# EAGLE design piezo-preamp-tickler_V3-single-supply-OPA1612 (EAGLE 8.3.2)
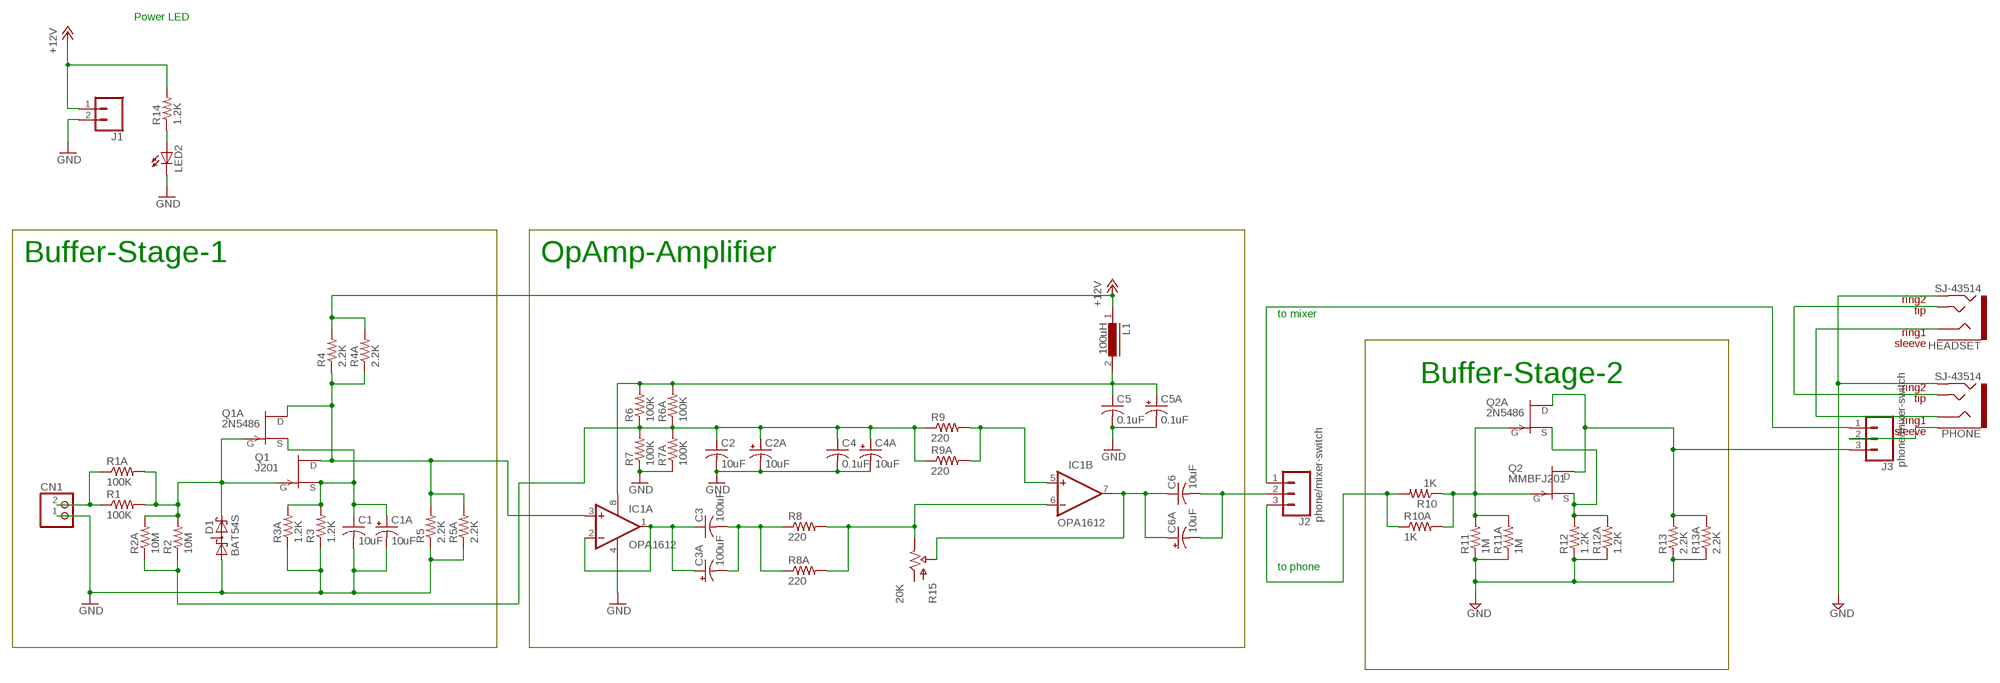
[diagram p0: schematic, sheet 1]

## Parts
C1  10uF  C-USC1206  [C1206]
C1A  10uF  CPOL-USE2,5-6E  [E2,5-6E]
C2  10uF  C-USC1206  [C1206]
C2A  10uF  CPOL-USE2,5-6E  [E2,5-6E]
C3  100uF  C-USC1206  [C1206]
C3A  100uF  CPOL-USE2,5-6E  [E2,5-6E]
C4  0.1uF  C-USC0805K  [C0805K]
C4A  10uF  CPOL-USE2,5-6E  [E2,5-6E]
C5  0.1uF  C-USC0805K  [C0805K]
C5A  0.1uF  CPOL-USE2,5-6E  [E2,5-6E]
C6  10uF  C-USC1206  [C1206]
C6A  10uF  CPOL-USE2,5-6E  [E2,5-6E]
CN1  JST_2PIN-THM  [JST-PH-2-THM]
D1  BAT54S  [SOT23]
HEADSET  SJ-43514  TRRS-3.5MMLGPADS  [TRRS_SJ-43514-SMT-TR]
IC1  OPA1612  OPA2134UA  [SO08]
J1  CONN_02LOCK  [1X02_LOCK]
J2  phone/mixer-switch  CONN_03LOCK  [1X03_LOCK]
J3  phone/mixer-switch  CONN_03LOCK  [1X03_LOCK]
L1  100uH  LBC-SE  [LBC-SE]
LED2  LED3MM  [LED3MM]
PHONE  SJ-43514  TRRS-3.5MMLGPADS  [TRRS_SJ-43514-SMT-TR]
Q1  J201  SST5484  [SOT23]
Q1A  2N5486  [TO92-]
Q2  MMBFJ201  SST5484  [SOT23]
Q2A  2N5486  [TO92-]
R1  100K  R-US_R0603  [R0603]
R1A  100K  R-US_0204/2V  [0204V]
R2  10M  R-US_R0603  [R0603]
R2A  10M  R-US_0204/2V  [0204V]
R3  1.2K  R-US_R0603  [R0603]
R3A  1.2K  R-US_0204/2V  [0204V]
R4  2.2K  R-US_R0603  [R0603]
R4A  2.2K  R-US_0204/2V  [0204V]
R5  2.2K  R-US_R0603  [R0603]
R5A  2.2K  R-US_0204/2V  [0204V]
R6  100K  R-US_R0603  [R0603]
R6A  100K  R-US_0204/2V  [0204V]
R7  100K  R-US_R0603  [R0603]
R7A  100K  R-US_0204/2V  [0204V]
R8  220  R-US_R0603  [R0603]
R8A  220  R-US_0204/2V  [0204V]
R9  220  R-US_R0603  [R0603]
R9A  220  R-US_0204/2V  [0204V]
R10  1K  R-US_R0603  [R0603]
R10A  1K  R-US_0204/2V  [0204V]
R11  1M  R-US_R0603  [R0603]
R11A  1M  R-US_0204/2V  [0204V]
R12  1.2K  R-US_R0603  [R0603]
R12A  1.2K  R-US_0204/2V  [0204V]
R13  2.2K  R-US_R0603  [R0603]
R13A  2.2K  R-US_0204/2V  [0204V]
R14  1.2K  R-US_0204/2V  [0204V]
R15  20K  POTTRIMPOT-MULTI  [TRIMPOT-MULTI]

## Nets
+12V: J1.1 L1.1 R4.2 R4A.2 R14.2
DRAINE1: IC1.3(A:+IN) Q1.1(D) Q1A.3(D) R4.1 R4A.1 R5.2 R5A.2
GATE1: D1.2(C2) Q1.3(G) Q1A.1(G) R1.2 R1A.2 R2.2 R2A.2
GATE2: Q2.3(G) Q2A.1(G) R10.1 R10A.2 R11.2 R11A.2
GND: C1.2 C1A.- C2.2 C2A.- C4.2 C4A.- C5.2 C5A.- CN1.1 D1.1(A1) HEADSET.RING2 IC1.4(A:V-) J1.2 LED2.K(C) PHONE.RING2 R3.1 R3A.1 R5.1 R5A.1 R7.1 R7A.1 R11.1 R11A.1 R12.1 R12A.1 R13.1 R13A.1
N$1: C3.1 C3A.+ IC1.1(A:OUT) IC1.2(A:-IN)
N$2: LED2.A R14.1
N$3: J2.3 R10.2 R10A.1
N$16: IC1.5(B:+IN) R9.2 R9A.2
N$22: IC1.6(B:-IN) R8.2 R8A.2 R15.P$1(OUT) R15.P$3(OUT) R15.P$4(OUT) R15.P$6(OUT) R15.P$9(OUT)
N$23: C6.2 C6A.- J2.2
N$24: CN1.2 R1.1 R1A.1
N$31: C6.1 C6A.+ IC1.7(B:OUT) R15.P$10(WIPER) R15.P$12(WIPER) R15.P$13(WIPER) R15.P$15(WIPER) R15.P$16(WIPER) R15.P$18(WIPER)
N$32: C5.1 C5A.+ IC1.8(A:V+) L1.2 R6.2 R6A.2
N$35: C2.1 C2A.+ C4.1 C4A.+ R2.1 R2A.1 R6.1 R6A.1 R7.2 R7A.2 R9.1 R9A.1
N$42: J2.1 J3.1
N$44: HEADSET.TIP PHONE.TIP
N$45: HEADSET.RING1 PHONE.RING1
N$46: J3.2 PHONE.EARTH
N$52: C3.2 C3A.- R8.1 R8A.1
NAME: J3.3 Q2.1(D) Q2A.3(D) R13.2 R13A.2
SOURCE: Q2.2(S) Q2A.2(S) R12.2 R12A.2
SOURCE1: C1.1 C1A.+ Q1.2(S) Q1A.2(S) R3.2 R3A.2
Unconnected: D1.3(C1A2) HEADSET.EARTH R15.P$20(IN) R15.P$21(IN) R15.P$22(IN) R15.P$24(IN) R15.P$27(IN)

## Notes on the sheet
- Power LED
- Buffer-Stage-1 | OpAmp-Amplifier
- to mixer
- Buffer-Stage-2
- to phone

## Library data of the parts
C1 C3-C6 = adafruit:C-US: CAPACITOR, American symbol
C1A C2A C3A C4A C5A C6A = rcl:CPOL-US: POLARIZED CAPACITOR, American symbol
C2 = rcl:C-US: CAPACITOR, American symbol
CN1 = adafruit:JST_2PIN: JST 2-Pin Connectors of various flavors SMT-RA (S2B-PH-SM4) 4UConnector #17311 SMT (B2B-PH-SM4) THM-RA (S2B-PH) THM (B2B-PH)
D1 = diode:BAT54S: Schottky Diodes Pin connection corrected 2011-05-04 Source: Fairchild .. BAT54.pdf
HEADSET PHONE = CMU-ArtFab:TRRS-3.5MM: Audio jack - 3.5mm TRRS variety - two rings.
IC1 = linear:OPA2*: Dual Operational Amplifier Low Power, Single-Supply, Rail-To-Rail Operational Amplifier Source: http://focus.ti.com/lit/ds/symlink/opa2345.pdf http://focus.ti.com .. opa241.pdf http://focus.ti.com/lit/ds/symlink/opa2134.pdf
J1 = SparkFun-Connectors:CONN_02: Multi connection point. Often used as Generic Header-pin footprint for 0.1 inch spaced/style header connections On any of the 0.1 inch spaced packages, you can populate with these: Break Away Headers - Straight <https://www.sparkfun.com/products/116> (PRT-00116) Break Away Male Headers - Right Angle <https://www.sparkfun.com/products/553> (PRT-00553) Female Headers <https://www.sparkfun.com/products/115> (PRT-00115) Break Away Headers - Machine Pin <https://www.sparkfun.com/products/117> (PRT-00117) Break Away Female Headers - Swiss Machine Pin <https://www.sparkfun.com/products/743> (PRT-00743) For SCREWTERMINALS and SPRING TERMINALS visit here: Screw Terimnals on SparkFun.com <https://www.sparkfun.com/search/results?term=Screw+Terminals> (5mm/3.5mm/2.54mm spacing) This device is also useful as a general connection point to wire up your design to another part of your project. Our various solder wires solder well into these plated through hole pads. Hook-Up Wire - Assortment (Stranded, 22 AWG) <https://www.sparkfun.com/products/11375> (PRT-11375) Hook-Up Wire - Assortment (Solid Core, 22 AWG) <https://www.sparkfun.com/products/11367> (PRT-11367) View the entire wire category on our website here <https://www.sparkfun.com/categories/141> Special notes: Molex polarized connector foot print use with: PRT-08233 with associated crimp pins and housings. 2.54_SCREWTERM for use with PRT-10571. 3.5mm Screw Terminal footprints for PRT-08084 5mm Screw Terminal footprints for use with PRT-08432
J2 J3 = SparkFun-Connectors:CONN_03: Multi connection point. Often used as Generic Header-pin footprint for 0.1 inch spaced/style header connections On any of the 0.1 inch spaced packages, you can populate with these: Break Away Headers - Straight <https://www.sparkfun.com/products/116> (PRT-00116) Break Away Male Headers - Right Angle <https://www.sparkfun.com/products/553> (PRT-00553) Female Headers <https://www.sparkfun.com/products/115> (PRT-00115) Break Away Headers - Machine Pin <https://www.sparkfun.com/products/117> (PRT-00117) Break Away Female Headers - Swiss Machine Pin <https://www.sparkfun.com/products/743> (PRT-00743) Stackable Header - 3 Pin (Female, 0.1") <https://www.sparkfun.com/products/13875> (PRT-13875) For SCREWTERMINALS and SPRING TERMINALS visit here: Screw Terimnals on SparkFun.com <https://www.sparkfun.com/search/results?term=Screw+Terminals> (5mm/3.5mm/2.54mm spacing) This device is also useful as a general connection point to wire up your design to another part of your project. Our various solder wires solder well into these plated through hole pads. Hook-Up Wire - Assortment (Stranded, 22 AWG) <https://www.sparkfun.com/products/11375> (PRT-11375) Hook-Up Wire - Assortment (Solid Core, 22 AWG) <https://www.sparkfun.com/products/11367> (PRT-11367) View the entire wire category on our website here <https://www.sparkfun.com/categories/141> Special notes: Molex polarized connector foot print use with SKU : PRT-08232 with associated crimp pins and housings.
L1 = inductors:LBC-SE: INDUCTOR
LED2 = led:LED: LED OSRAM: - CHIPLED LG R971, LG N971, LY N971, LG Q971, LY Q971, LO R971, LY R971 LH N974, LH R974 LS Q976, LO Q976, LY Q976 LO Q996 - Hyper CHIPLED LW Q18S LB Q993, LB Q99A, LB R99A - SideLED LS A670, LO A670, LY A670, LG A670, LP A670 LB A673, LV A673, LT A673, LW A673 LH A674 LY A675 LS A676, LA A676, LO A676, LY A676, LW A676 LS A679, LY A679, LG A679 - Hyper Micro SIDELED® LS Y876, LA Y876, LO Y876, LY Y876 LT Y87S - SmartLED LW L88C, LW L88S LB L89C, LB L89S, LG L890 LS L89K, LO L89K, LY L89K LS L896, LA L896, LO L896, LY L896 - TOPLED LS T670, LO T670, LY T670, LG T670, LP T670 LSG T670, LSP T670, LSY T670, LOP T670, LYG T670 LG T671, LOG T671, LSG T671 LB T673, LV T673, LT T673, LW T673 LH T674 LS T676, LA T676, LO T676, LY T676, LB T676, LH T676, LSB T676, LW T676 LB T67C, LV T67C, LT T67C, LS T67K, LO T67K, LY T67K, LW E67C LS E67B, LA E67B, LO E67B, LY E67B, LB E67C, LV E67C, LT E67C LW T67C LS T679, LY T679, LG T679 LS T770, LO T770, LY T770, LG T770, LP T770 LB T773, LV T773, LT T773, LW T773 LH T774 LS E675, LA E675, LY E675, LS T675 LS T776, LA T776, LO T776, LY T776, LB T776 LHGB T686 LT T68C, LB T68C - Hyper Mini TOPLED® LB M676 - Mini TOPLED Santana® LG M470 LS M47K, LO M47K, LY M47K Source: http://www.osram.convergy.de LUXEON: - LUMILED® LXK2-PW12-R00, LXK2-PW12-S00, LXK2-PW14-U00, LXK2-PW14-V00 LXK2-PM12-R00, LXK2-PM12-S00, LXK2-PM14-U00 LXK2-PE12-Q00, LXK2-PE12-R00, LXK2-PE12-S00, LXK2-PE14-T00, LXK2-PE14-U00 LXK2-PB12-K00, LXK2-PB12-L00, LXK2-PB12-M00, LXK2-PB14-N00, LXK2-PB14-P00, LXK2-PB14-Q00 LXK2-PR12-L00, LXK2-PR12-M00, LXK2-PR14-Q00, LXK2-PR14-R00 LXK2-PD12-Q00, LXK2-PD12-R00, LXK2-PD12-S00 LXK2-PH12-R00, LXK2-PH12-S00 LXK2-PL12-P00, LXK2-PL12-Q00, LXK2-PL12-R00 Source: www.luxeon.com KINGBRIGHT: KA-3528ASYC Source: www.kingbright.com
Q1 Q2 = transistor-fet:?548*: N-Channel JFETs Source: VISHAY 2N5484.pdf Compatible: TO92 2N5245 J304 J305 U310 J308 J309 J310 TO72 2N4416 2N4416A 2N3823 2N4351 3N169 3N170 3N171 MFE3002 TO18 2N3796 2N3797 MFE825 Source: Motorola European Master Guide Pacge 3-59
Q1A Q2A = CMU-ArtFab:?548*: N-Channel JFETs Source: VISHAY 2N5484.pdf Compatible: TO92 2N5245 J304 J305 U310 J308 J309 J310 TO72 2N4416 2N4416A 2N3823 2N4351 3N169 3N170 3N171 MFE3002 TO18 2N3796 2N3797 MFE825 Source: Motorola European Master Guide Pacge 3-59
R1 R1A R2 R2A R3 R3A R4 R4A R5 R5A R6 R6A R7 R7A R8 R8A R9 R9A R10 R10A R11 R11A R12 R12A R13 R13A R14 = CMU-ArtFab:R-US_: RESISTOR, American symbol
R15 = CMU-ArtFab:POT: http://www.taydaelectronics.com/10k-ohm-linear-taper-potentiometer-round-shaft-pcb-9mm.html http://www.taydaelectronics.com/datasheets/A-1847.pdf

## Net classes
0 default: width 0.152 mm, clearance 0.2 mm

## Board
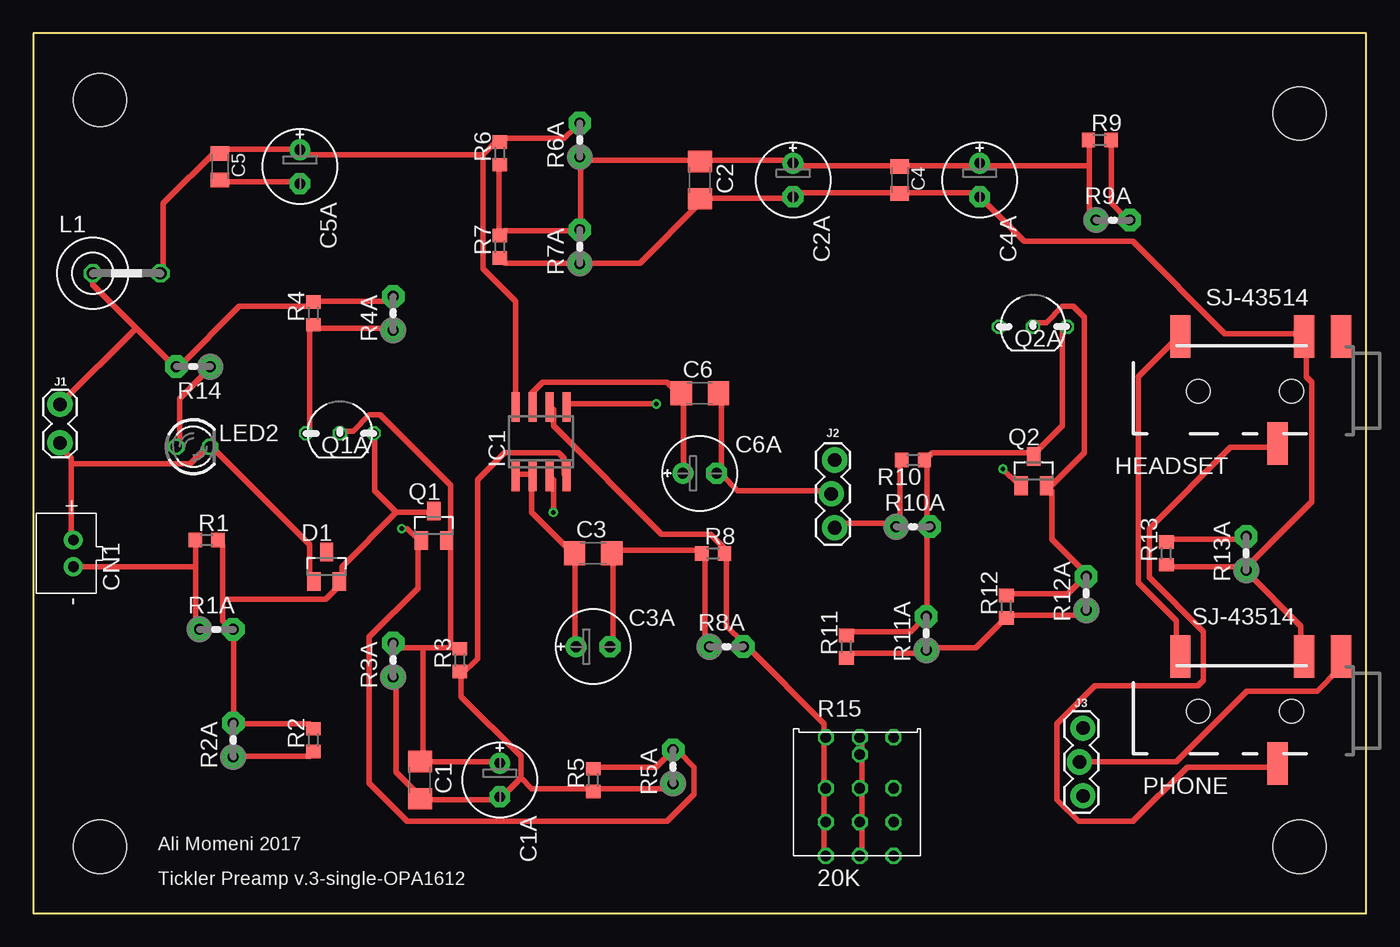
[diagram p1: board, top side]
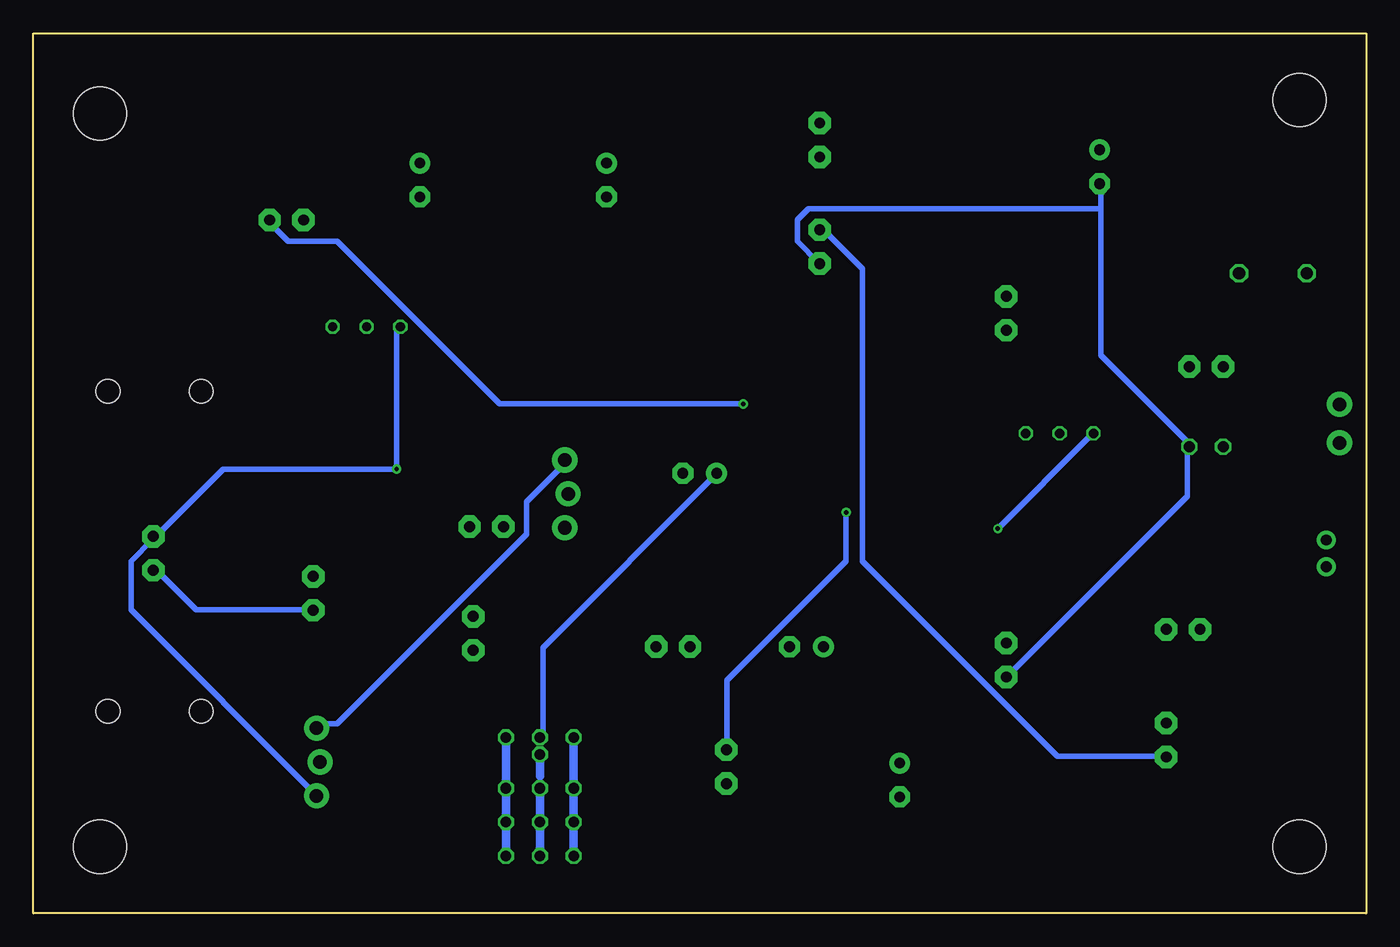
[diagram p2: board, bottom side, seen from below]

Size 100 x 66 mm. Coordinates in mm from the lower left corner, seen from the top.
Outline: 0,0 100,0 100,66 0,66 0,0
Copper layers (1*16): Top 0.0356mm / dielectric 1.5011mm / Bottom 0.0356mm
Design rules "oshpark-2layer *": minimum track width 16mil, minimum drill 13mil, track to track 16mil, track to pad 16mil, pad to pad 16mil, via to via 16mil, smd to smd 16mil, copper to edge 15mil, drill to drill 6mil, minimum pad ring 7mil, minimum via ring 7mil, stop-mask expansion 2.5mil, vias tented up to drill 0mil, thermal gap 10mil
Holes 4 mm at 5,5 95,5 5,61 95,60

### Footprints (pad centres in the part's own frame; a part is rotated, then mirrored left to right if it is on the bottom)
C1206 = smd 1.6 x 1.8: 1 -1.4,0; 2 1.4,0
E2,5-6E = drill 0.813 pad 1.575: + -1.27,0 | drill 0.813 pad 1.575 octagon: - 1.27,0
C0805K = smd 1.1 x 1.4: 1 -1,0; 2 1,0
JST-PH-2-THM = drill 0.8 pad 1.422: 1 1,0; 2 -1,0
SOT23 = smd 1 x 1.4: 1 -0.95,-1.1; 2 0.95,-1.1; 3 0,1.1
TRRS_SJ-43514-SMT-TR = smd 1.524 x 3.175: EARTH -2.114,-5.271; RING1 2.644,2.759; RING2 0.66,-5.271; TIP 9.948,-5.271 | hole 1.778: 1.6,-1.15; 8.6,-1.15
SO08 = smd 0.6 x 2.2: 1 -1.905,-2.6; 2 -0.635,-2.6; 3 0.635,-2.6; 4 1.905,-2.6; 5 1.905,2.6; 6 0.635,2.6; 7 -0.635,2.6; 8 -1.905,2.6
1X02_LOCK = drill 1.016 pad 1.88: 1 -0.178,0; 2 2.718,0
1X03_LOCK = drill 1.016 pad 1.88: 1 0,0.127; 2 2.54,-0.127; 3 5.08,0.127
LBC-SE = drill 0.914 octagon: 1 -2.54,0; 2 2.54,0
LED3MM = drill 0.813 octagon: A -1.27,0; K 1.27,0
TO92- = drill 0.7 octagon: 1 2.54,0; 2 0,0; 3 -2.54,0
R0603 = smd 1 x 1.1: 1 -0.85,0; 2 0.85,0
0204V = drill 0.813 pad 1.676 octagon: 1 -1.27,0; 2 1.27,0
TRIMPOT-MULTI = drill 0.8 octagon: P$1 -2.54,-4.699; P$3 -2.54,-2.159; P$4 -2.54,-2.159; P$6 -2.54,0.381; P$9 -2.54,4.191; P$10 0,-4.699; P$12 0,-2.159; P$13 0,-2.159; P$15 0,0.381; P$16 0,2.921; P$18 0,4.191; P$20 2.54,-4.699; P$21 2.54,-2.159; P$22 2.54,-2.159; P$24 2.54,0.381; P$27 2.54,4.191

### Placement (x,y rotation side)
C1  29,10 270 top
C1A  35,10 270 top
C2  50,55 270 top
C2A  57,55 270 top
C3  42,27 0 top
C3A  42,20 0 top
C4  65,55 270 top
C4A  71,55 270 top
C5  14,56 270 top
C5A  20,56 270 top
C6  50,39 0 top
C6A  50,33 0 top
CN1  3,27 90 top
D1  22,26 0 top
HEADSET  96,38 180 top
IC1  38.09,35.37 0 top
J1  2,38 270 top
J2  60,34 270 top
J3  78.62,13.89 270 top
L1  7,48 0 top
LED2  12,35 0 top
PHONE  96,14 180 top
Q1  30.05,29.07 0 top
Q1A  23,36 0 top
Q2  75.05,33.17 0 top
Q2A  75,44 0 top
R1  13,28 0 top
R1A  13.73,21.3 0 top
R2  21,13 90 top
R2A  15,13 90 top
R3  32,19 90 top
R3A  27,19 90 top
R4  21,45 90 top
R4A  27,45 90 top
R5  42,10 90 top
R5A  48,11 90 top
R6  35,57 90 top
R6A  41,58 90 top
R7  35,50 90 top
R7A  41,50 90 top
R8  51,27 0 top
R8A  52,20 0 top
R9  80,58 0 top
R9A  81,52 0 top
R10  66,34 180 top
R10A  66,29 0 top
R11  61,20 90 top
R11A  67,21 90 top
R12  73,23 90 top
R12A  79,24 90 top
R13  85,27 90 top
R13A  91,27 90 top
R14  12,41 180 top
R15  62,9 0 top

### Tracks (layer width: path | path; a pad name or v marks a point on that pad's centre or on a via)
+12V
  Top 0.406: R4A.2 26.82,45.92 21.13,45.92 R4.2 20.73,45.52 15.44,45.52 10.97,41.05 R14.2 10.57,41.05 7.72,43.89 | 7.72,43.89 4.47,47.14 4.47,47.95 L1.1 | 7.72,43.89 2.03,38.2 J1.1
DRAINE1  (via drill 0.33)
  Top 0.406: R4A.1 26.82,43.89 21.13,43.89 R4.1 20.73,43.89 20.73,36.17 Q1A.3 | v27.64,28.85 28.04,28.85 28.85,28.04 Q1.1 28.85,27.64 28.85,24.38 25.2,20.73 25.2,9.75 28.04,6.91 47.55,6.91 49.58,8.94 49.58,10.97 48.36,12.19 R5A.2 47.95,12.19 46.74,10.97 42.27,10.97 R5.2 | v39.01,30.07 39.01,32.51 IC1.3
  Bottom 0.406: v27.64,28.85 20.73,35.76 Q1A.3 | v39.01,30.07 39.01,26.42 47.95,17.48 47.95,12.6 R5A.2
GATE1
  Top 0.406: 27.23,30.07 23.16,26.01 23.16,25.2 D1.2 22.76,24.79 22.76,24.38 21.95,23.57 14.22,23.57 | 27.23,30.07 29.67,30.07 Q1.3 | 27.23,30.07 25.6,31.7 25.6,35.76 Q1A.1 | R2.2 20.73,14.22 15.04,14.22 R2A.2 15.04,14.63 15.04,21.13 R1A.2 14.63,21.54 14.22,21.95 14.22,23.57 | 14.22,23.57 14.22,27.64 R1.2
GATE2
  Top 0.406: R11.2 61.37,21.13 65.84,21.13 66.65,21.95 R11A.2 67.06,22.35 67.06,28.85 R10A.2 67.06,29.26 67.06,33.73 R10.1 67.06,34.14 67.46,34.54 74.78,34.54 Q2.3 75.18,34.54 77.22,36.58 77.22,43.89 Q2A.1
GND
  Top 0.406: R11.1 61.37,19.51 66.65,19.51 R11A.1 67.06,19.91 70.71,19.91 72.75,21.95 R12.1 73.15,22.35 78.84,22.35 R12A.1 | R13.1 85.34,26.01 90.63,26.01 R13A.1 | PHONE.RING2 95.1,19.51 95.1,21.54 91.03,25.6 R13A.1 | R13A.1 91.03,26.01 95.91,30.89 95.91,39.83 95.5,40.23 95.5,43.08 HEADSET.RING2 95.1,43.48 89.41,43.48 82.5,50.39 74.37,50.39 71.12,53.65 C4A.- 70.71,54.05 65.02,54.05 C4.2 64.62,54.05 57.3,54.05 C2A.- 56.9,53.65 50.39,53.65 C2.2 49.99,53.24 45.52,48.77 41.05,48.77 R7A.1 40.64,48.77 35.36,48.77 R7.1 | R5A.1 47.95,9.35 42.27,9.35 R5.1 41.86,9.35 37.39,9.35 36.58,10.16 | 32.11,17.88 32.11,16.26 36.58,11.79 36.58,10.16 | 36.58,10.16 35.36,8.94 C1A.- 34.95,8.53 29.26,8.53 C1.2 28.85,8.94 27.23,10.57 27.23,17.48 R3A.1 | 32.11,17.88 33.33,19.1 33.33,32.51 35.36,34.54 39.42,34.54 39.83,34.14 39.83,32.92 IC1.4 | 32.11,17.88 R3.1 | 2.85,33.73 2.85,34.14 2.03,34.95 J1.2 | 2.85,33.73 2.85,28.04 CN1.1 | C5.2 14.22,54.86 19.91,54.86 C5A.- | D1.1 20.73,25.2 20.73,27.64 13.41,34.95 LED2.K 13.01,34.95 11.79,33.73 2.85,33.73
  Bottom 0.406: R12A.1 79.25,22.76 87.78,22.76 90.63,25.6 R13A.1 | 19.91,52.83 19.91,41.86 13.41,35.36 LED2.K 13.41,34.95 13.41,31.29 26.82,17.88 R3A.1 | 19.91,52.83 19.91,54.46 C5A.- | 19.91,52.83 41.86,52.83 42.67,52.02 42.67,50.39 41.05,48.77 R7A.1
N$1
  Top 0.406: IC1.1 36.17,32.92 37.39,32.92 IC1.2 37.39,32.51 37.39,30.07 40.23,27.23 C3.1 40.64,26.82 40.64,20.32 C3A.+
N$2
  Top 0.406: LED2.A 10.97,35.36 10.97,38.61 13.01,40.64 R14.1
N$3
  Top 0.406: R10.2 65.02,33.73 65.02,29.26 R10A.1 64.62,29.26 60.15,29.26 J2.3
N$16  (via drill 0.33)
  Top 0.406: R9.2 80.87,57.71 80.87,53.24 82.09,52.02 R9A.2 | v46.74,38.2 40.23,38.2 IC1.5
  Bottom 0.406: v46.74,38.2 65.02,38.2 77.22,50.39 80.87,50.39 82.09,51.61 R9A.2
N$22
  Top 0.406: R15.P$1 59.33,4.47 59.33,6.5 R15.P$4 59.33,6.91 59.33,9.35 R15.P$6 59.33,9.75 59.33,13.01 R15.P$9 59.33,13.41 59.33,14.22 53.65,19.91 R8A.2 53.24,20.32 52.02,21.54 52.02,26.82 R8.2 52.02,27.23 50.8,28.45 47.14,28.45 39.01,36.58 39.01,37.8 IC1.6
N$23
  Top 0.406: C6.2 51.61,38.61 51.61,33.33 C6A.- 51.61,32.92 52.83,31.7 59.74,31.7 J2.2
N$24
  Top 0.406: 12.19,26.01 12.19,21.54 R1A.1 | 12.19,26.01 12.19,27.64 R1.1 | 12.19,26.01 3.25,26.01 CN1.2
N$31
  Top 0.406: R15.P$10 62.18,4.47 62.18,6.5 R15.P$13 62.18,6.91 62.18,9.35 R15.P$15 62.18,9.75 62.18,11.79 R15.P$16 62.18,12.19 62.18,13.01 R15.P$18 | C6A.+ 48.77,33.33 48.77,38.61 C6.1 48.36,39.01 47.55,39.83 38.2,39.83 37.39,39.01 37.39,38.2 IC1.7
  Bottom 0.406: R15.P$18 61.77,13.41 61.77,19.91 48.77,32.92 C6A.+
N$32
  Top 0.406: L1.2 9.75,48.36 9.75,53.24 13.82,57.3 C5.1 14.22,57.3 19.91,57.3 C5A.+ 20.32,56.9 33.73,56.9 | R6A.2 40.64,58.93 39.83,58.12 35.36,58.12 R6.2 34.95,58.12 33.73,56.9 | 33.73,56.9 33.73,48.36 36.17,45.92 36.17,38.2 IC1.8
N$35
  Top 0.406: 79.25,56.08 79.25,52.43 79.65,52.02 R9A.1 | 79.25,56.08 79.25,57.71 R9.1 | 79.25,56.08 71.12,56.08 C4A.+ 70.71,56.08 65.02,56.08 C4.1 64.62,56.08 57.3,56.08 C2A.+ 56.9,56.49 50.39,56.49 C2.1 49.99,56.49 41.05,56.49 | R2.1 20.73,11.79 15.04,11.79 R2A.1 | R6.1 34.95,56.08 34.95,51.21 R7.2 35.36,51.21 40.64,51.21 R7A.2 41.05,51.61 41.05,56.49 | 41.05,56.49 R6A.1
  Bottom 0.406: R2A.1 15.04,11.79 23.16,11.79 37.8,26.42 37.8,48.36 40.64,51.21 R7A.2
N$42
  Bottom 0.406: J2.1 60.15,33.73 62.99,30.89 62.99,28.45 77.22,14.22 78.44,14.22 J3.1
N$44
  Top 0.406: PHONE.TIP 85.75,19.51 85.75,21.95 82.91,24.79 82.91,40.23 85.75,43.08 HEADSET.TIP
N$45
  Top 0.406: PHONE.RING1 93.07,10.97 86.56,10.97 82.5,6.91 78.44,6.91 76.81,8.53 76.81,14.22 79.65,17.07 87.38,17.07 87.78,17.48 87.78,21.13 83.72,25.2 83.72,28.85 89.81,34.95 93.07,34.95 HEADSET.RING1
N$46
  Top 0.406: PHONE.EARTH 97.94,19.1 97.94,18.29 96.32,16.66 91.03,16.66 85.75,11.38 78.84,11.38 J3.2
N$52
  Top 0.406: C3A.- 43.48,20.32 43.48,26.82 C3.2 43.48,27.23 49.99,27.23 R8.1 50.39,26.82 50.39,20.32 R8A.1
NAME  (via drill 0.33)
  Top 0.406: v72.75,33.33 73.97,32.11 Q2.1 | R13.2 85.34,28.04 90.63,28.04 R13A.2
  Bottom 0.406: Q2A.3 72.75,43.89 v72.75,33.33 85.75,33.33 90.63,28.45 R13A.2 91.03,28.04 92.66,26.42 92.66,22.76 78.84,8.94 J3.3
SOURCE
  Top 0.406: R12.2 73.15,23.98 77.62,23.98 78.84,25.2 R12A.2 78.84,25.6 76.4,28.04 76.4,31.7 Q2.2 76.4,32.11 78.84,34.54 78.84,44.7 78.03,45.52 77.22,45.52 76,44.3 75.18,44.3 Q2A.2
SOURCE1
  Top 0.406: C1A.+ 34.95,11.38 29.26,11.38 C1.1 29.26,11.79 29.26,19.91 | 29.26,19.91 27.23,19.91 R3A.2 | 29.26,19.91 31.29,19.91 | 31.29,19.91 31.7,19.91 R3.2 | 31.29,19.91 31.29,27.64 Q1.2 31.29,28.04 31.29,32.11 26.01,37.39 25.2,37.39 23.98,36.17 23.16,36.17 Q1A.2

### Text on the board
tNames: Ali Momeni 2017 | Tickler Preamp v.3-single-OPA1612